# Altium schematic sheet Predajnik.SchDoc
size A3
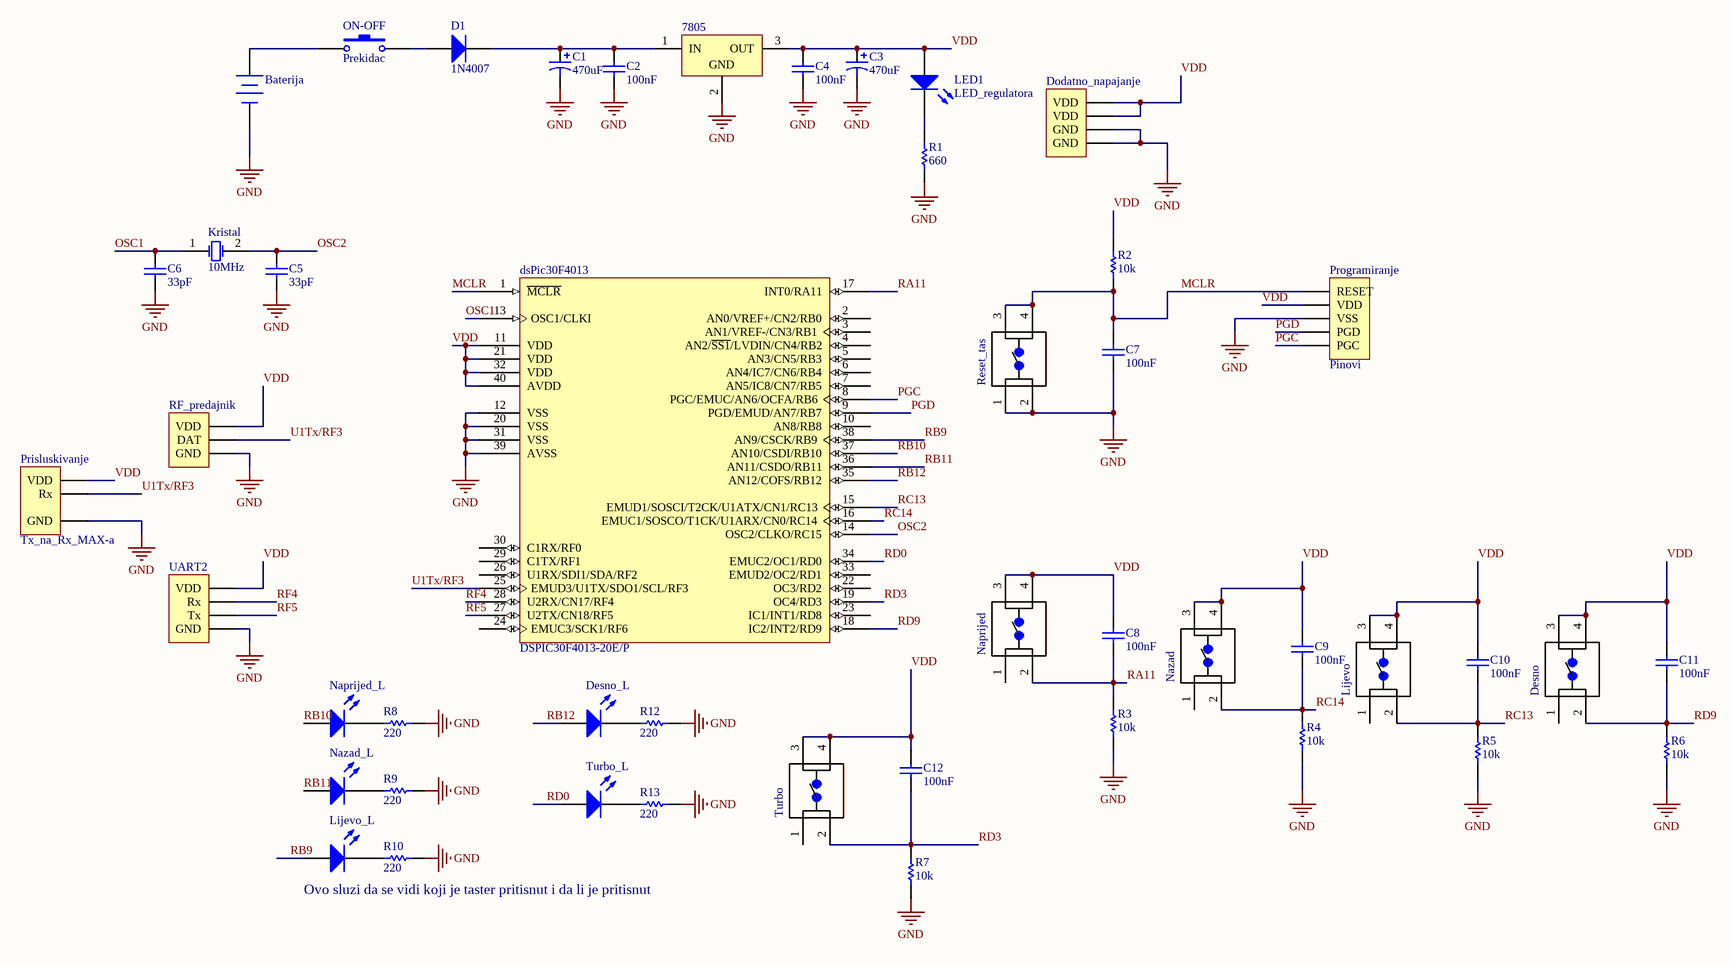
[diagram p0: Predajnik.SchDoc]

## Parts
7805  LM7805CT  [T03B]  (value not drawn)
Baterija  9V  [BAT-2]  (value not drawn)
C1  470uF  [El. Kondenzator 470uf]
C2  100nF  [C blok 100n]
C3  470uF  [El. Kondenzator 470uf]
C4  100nF  [C blok 100n]
C5  33pF  [C keramicki 30pF]
C6  33pF  [C keramicki 30pF]
C7  100nF  [C blok 100n]
C8  100nF  [C blok 100n]
C9  100nF  [C blok 100n]
C10  100nF  [C blok 100n]
C11  100nF  [C blok 100n]
C12  100nF  [C blok 100n]
D1  1N4007  [DO-41]
Desno  3-1825910-1  [*TE_3-1825910-1]  (value not drawn)
Desno_L  LED0  [LED_5mm]  (value not drawn)
Dodatno_napajanje  (no value)  [HDR1X4]
dsPic30F4013  DSPIC30F4013-20E/P  [PDIP600-P40]
Kristal  10MHz  [R38]
LED1  LED_regulatora  [LED_5mm]
Lijevo  3-1825910-1  [*TE_3-1825910-1]  (value not drawn)
Lijevo_L  LED0  [LED_5mm]  (value not drawn)
Naprijed  3-1825910-1  [*TE_3-1825910-1]  (value not drawn)
Naprijed_L  LED0  [LED_5mm]  (value not drawn)
Nazad  3-1825910-1  [*TE_3-1825910-1]  (value not drawn)
Nazad_L  LED0  [LED_5mm]  (value not drawn)
ON-OFF  Prekidac  [SPST-2]
Prisluskivanje  Tx_na_Rx_MAX-a  [HDR1X3]
Programiranje  Pinovi  [HDR1X5]
R1  660  [AXIAL-0.3]
R2  10k  [AXIAL-0.3]
R3  10k  [AXIAL-0.3]
R4  10k  [AXIAL-0.3]
R5  10k  [AXIAL-0.3]
R6  10k  [AXIAL-0.3]
R7  10k  [AXIAL-0.3]
R8  220  [AXIAL-0.3]
R9  220  [AXIAL-0.3]
R10  220  [AXIAL-0.3]
R12  220  [AXIAL-0.3]
R13  220  [AXIAL-0.3]
Reset_tas  3-1825910-1  [*TE_3-1825910-1]  (value not drawn)
RF_predajnik  Header 3  [HDR1X3]  (value not drawn)
Turbo  3-1825910-1  [*TE_3-1825910-1]  (value not drawn)
Turbo_L  LED0  [LED_5mm]  (value not drawn)
UART2  (no value)  [HDR1X4]

## Nets
GND: 7805.2(GND) Baterija.2(-) C1.2 C2.1 C3.2 C4.1 C5.1 C6.1 C7.1 Dodatno_napajanje.3(GND) Dodatno_napajanje.4(GND) dsPic30F4013.12(VSS) dsPic30F4013.20(VSS) dsPic30F4013.31(VSS) dsPic30F4013.39(AVSS) Prisluskivanje.3(GND) Programiranje.3(VSS) R1.1 R3.1 R4.1 R5.1 R6.1 R7.1 R8.2 R9.2 R10.2 R12.2 R13.2 Reset_tas.1 Reset_tas.2 RF_predajnik.3(GND) UART2.4(GND)
MCLR: C7.2 dsPic30F4013.1(~{MCLR}) Programiranje.1(RESET) R2.1 Reset_tas.3 Reset_tas.4
OSC1: C6.2 dsPic30F4013.13(OSC1/CLKI) Kristal.1(OSC1)
OSC2: C5.2 dsPic30F4013.14(OSC2/CLKO/RC15) Kristal.2(OSC2)
PGC: dsPic30F4013.8(PGC/EMUC/AN6/OCFA/RB6) Programiranje.5(PGC)
PGD: dsPic30F4013.9(PGD/EMUD/AN7/RB7) Programiranje.4(PGD)
RA11: C8.1 dsPic30F4013.17(INT0/RA11) Naprijed.2 R3.2
RB9: dsPic30F4013.38(AN9/CSCK/RB9) Lijevo_L.1(A)
RB10: dsPic30F4013.37(AN10/CSDI/RB10) Naprijed_L.1(A)
RB11: dsPic30F4013.36(AN11/CSDO/RB11) Nazad_L.1(A)
RB12: Desno_L.1(A) dsPic30F4013.35(AN12/COFS/RB12)
RC13: C10.1 dsPic30F4013.15(EMUD1/SOSCI/T2CK/U1ATX/CN1/RC13) Lijevo.2 R5.2
RC14: C9.1 dsPic30F4013.16(EMUC1/SOSCO/T1CK/U1ARX/CN0/RC14) Nazad.2 R4.2
RD0: dsPic30F4013.34(EMUC2/OC1/RD0) Turbo_L.1(A)
RD3: C12.1 dsPic30F4013.19(OC4/RD3) R7.2 Turbo.2
RD9: C11.1 Desno.2 dsPic30F4013.18(IC2/INT2/RD9) R6.2
RF4: dsPic30F4013.28(U2RX/CN17/RF4) UART2.2(Rx)
RF5: dsPic30F4013.27(U2TX/CN18/RF5) UART2.3(Tx)
U1Tx/RF3: dsPic30F4013.25(EMUD3/U1TX/SDO1/SCL/RF3) Prisluskivanje.2(Rx) RF_predajnik.2(DAT)
VDD: 7805.3(OUT) C3.1 C4.2 C8.2 C9.2 C10.2 C11.2 C12.2 Desno.3 Desno.4 Dodatno_napajanje.1(VDD) Dodatno_napajanje.2(VDD) dsPic30F4013.11(VDD) dsPic30F4013.21(VDD) dsPic30F4013.32(VDD) dsPic30F4013.40(AVDD) LED1.1(A) Lijevo.3 Lijevo.4 Naprijed.3 Naprijed.4 Nazad.3 Nazad.4 Prisluskivanje.1(VDD) Programiranje.2(VDD) R2.2 RF_predajnik.1(VDD) Turbo.3 Turbo.4 UART2.1(VDD)
Net7805_1: 7805.1(IN) C1.1 C2.2 D1.2(K)
NetBaterija_1: Baterija.1(+) ON-OFF.1
NetD1_1: D1.1(A) ON-OFF.2
NetDesno_L_2: Desno_L.2(K) R12.1
NetLED1_2: LED1.2(K) R1.2
NetLijevo_L_2: Lijevo_L.2(K) R10.1
NetNaprijed_L_2: Naprijed_L.2(K) R8.1
NetNazad_L_2: Nazad_L.2(K) R9.1
NetR13_1: R13.1 Turbo_L.2(K)

Not connected (* = marked no-connect by the designer): Desno 1; dsPic30F4013 2(AN0/VREF+/CN2/RB0) 3(AN1/VREF-/CN3/RB1) 4(AN2/~{SS1}/LVDIN/CN4/RB2) 5(AN3/CN5/RB3) 6(AN4/IC7/CN6/RB4) 7(AN5/IC8/CN7/RB5) 10(AN8/RB8) 22(OC3/RD2) 23(IC1/INT1/RD8) 24(EMUC3/SCK1/RF6) 26(U1RX/SDI1/SDA/RF2) 29(C1TX/RF1) 30(C1RX/RF0) 33(EMUD2/OC2/RD1); Lijevo 1; Naprijed 1; Nazad 1; Turbo 1

## Notes on the sheet
- Ovo sluzi da se vidi koji je taster pritisnut i da li je pritisnut

## Library data of the parts
7805 = LM7905CT: 3-Terminal Negative Regulator, 3-pin TO-220; Manufacturer: National Semiconductor; PackageTopMarking: NSUZXYTTE#*LM7905CT; PowerWise: N; CompType: LDO IC; Published: 4-Dec-2008; DatasheetVersion: Sep-2001; PackageVersion: revL, Jan-1992; PackageReference: T03B; Publisher: Altium Limited; PackageDescription: TO-220, Molded, 3 Lead, Straight; Supplier 1: Farnell; Supplier Part Number 1: 9490370; PartNumber: LM7905CT; RoHS: N; PinCount: 3; ComponentLink1Description: LM7905 Datasheet; ComponentLink1URL: http://www.national.com/ds/LM/LM7905.pdf; ComponentLink2Description: LM7905 Web Page; ComponentLink2URL: http://www.national.com/pf/LM/LM7905.html; ComponentLink3Description: T03B Package Page; ComponentLink3URL: http://www.national.com/packaging/folders/t03b.html
Baterija = Battery: Multicell Battery; Published: 24-Mar-1999; LatestRevisionDate: 17-Jul-2002; LatestRevisionNote: Re-released for DXP Platform.; PackageReference: BAT-2; Publisher: Altium Limited; PackageDescription: Battery; 2 Leads
C1 C3 = Cap Pol1: Polarized Capacitor (Radial); Published: 8-Jun-2000; LatestRevisionDate: 17-Jul-2002; LatestRevisionNote: Re-released for DXP Platform.; PackageReference: RB7.6-15; Publisher: Altium Limited; PackageDescription: Polarized Capacitor (Radial); 2 Leads; Value: 470uF
C2 C4-C12 = Cap: Capacitor; Published: 8-Jun-2000; LatestRevisionDate: 17-Jul-2002; LatestRevisionNote: Re-released for DXP Platform.; PackageReference: RAD-0.3; Publisher: Altium Limited; PackageDescription: Radial Cap, Thru-Hole; 2 Leads; 0.3 in Pin Spacing
  C2 C4 C7-C12: Value: 100nF
  C5 C6: Value: 33pF
D1 = Diode 1N4007: 1 Amp General Purpose Rectifier; Published: 8-Jun-2000; LatestRevisionDate: 17-Jul-2002; LatestRevisionNote: Re-released for DXP Platform.; DatasheetVersion: 1998; PackageVersion: Aug-1999; PackageReference: DO-41; Publisher: Altium Limited; PackageDescription: Diode, Axial; Body 5.2 x 2.7 mm (LxDia. max), Lead Dia. 0.86 mm (max); Code_JEDEC: DO-204-AL; ComponentLink1Description: Manufacturer Link; ComponentLink1URL: http://www.fairchildsemi.com/; ComponentLink2Description: Datasheet; ComponentLink2URL: http://www.fairchildsemi.com/ds/1N%2F1N4001.pdf
Desno Lijevo Naprijed Nazad Reset_tas Turbo = 3-1825910-1: Switch Push Button OFF _ON_ SPST Round Button 0.05A 24VDC Momentary Contact PC Pins Thru-Hole; MF: TE Connectivity; Package: None; Price: None; SnapEDA_Link: https://www.snapeda.com/parts/3-1825910-1/TE%20Connectivity%20ALCOSWITCH%20Switches/view-part/452461/?ref=snap; TE_purchase_URL: https://www.te.com/usa-en/product-3-1825910-1.html?te_bu=Cor&te_type=disp&te_campaign=seda_glo_cor-seda-global-disp-prtnr-fy19-seda-model-bom-cta_sma-317_1&elqCampaignId=32493; MP: 3-1825910-1; EU_RoHS_Compliance: Compliant; Availability: Unavailable; Value: *
Desno_L Lijevo_L Naprijed_L Nazad_L Turbo_L = LED0: Typical INFRARED GaAs LED; Published: 8-Jun-2000; LatestRevisionDate: 08-Jul-2005; LatestRevisionNote: Mech Layer 1 removed.; PackageReference: LED-0; Publisher: Altium Limited; PackageDescription: LED; 2 Leads
Dodatno_napajanje Prisluskivanje UART2 = Header 4: Header, 4-Pin; LatestRevisionDate: 17-Jul-2002; LatestRevisionNote: Re-released for DXP Platform.; Publisher: Altium Limited
dsPic30F4013 = DSPIC30F4013-20E/P: High-Performance 16-bit Digital Signal Controller, 48 KB Flash, 2 KB SRAM, 1 KB EEPROM, 40-Pin PDIP, Extended High Temperature; Published: 29-Jan-2009; DatasheetVersion: revF, Apr-2008; PackageVersion: revBB, Aug-2009; PackageReference: PDIP600-P40; Publisher: Altium Limited; PackageDescription: 40-Lead Plastic Dual In-Line (P) - 600 mil Body [PDIP]; Supplier 1: Digi-Key; Supplier Part Number 1: DSPIC30F4013-20EP-ND; ComponentLink1Description: Datasheet; ComponentLink1URL: http://ww1.microchip.com/downloads/en/DeviceDoc/70138F.pdf; ComponentLink2Description: Packaging Specification; ComponentLink2URL: http://www.microchip.com/stellent/groups/techpub_sg/documents/packagingspec/en012702.pdf; ComponentLink3Description: Microchip.com Home; ComponentLink3URL: http://www.microchip.com/
Kristal = XTAL: Crystal Oscillator; Published: 8-Jun-2000; LatestRevisionDate: 17-Jul-2002; LatestRevisionNote: Re-released for DXP Platform.; PackageReference: R38; Publisher: Altium Limited; PackageDescription: Crystal, Thru-Hole; 2 Leads; Body 3.1 x 8.2 mm (Dia.xH)
LED1 = LED1: Typical RED GaAs LED; Published: 8-Jun-2000; LatestRevisionDate: 08-Jul-2005; LatestRevisionNote: Mech Layer 1 removed.; PackageReference: LED-1; Publisher: Altium Limited; PackageDescription: LED; 2 Leads
ON-OFF = SW-PB: Switch; Published: 24-Mar-1999; LatestRevisionDate: 17-Jul-2002; LatestRevisionNote: Re-released for DXP Platform.; PackageReference: SPST-2; Publisher: Altium Limited; PackageDescription: Switch; 2 Leads
Programiranje = Header 5: Header, 5-Pin; LatestRevisionDate: 17-Jul-2002; LatestRevisionNote: Re-released for DXP Platform.; Publisher: Altium Limited
R1-R10 R12 R13 = Res1: Resistor; Published: 8-Jun-2000; LatestRevisionDate: 17-Jul-2002; LatestRevisionNote: Re-released for DXP Platform.; PackageReference: AXIAL-0.3; Publisher: Altium Limited; PackageDescription: Axial Device, Thru-Hole; 2 Leads; 0.3 in Pin Spacing
  R1: Value: 660
  R2-R7: Value: 10K
  R8-R10 R12 R13: Value: 220
RF_predajnik = Header 3: Header, 3-Pin; LatestRevisionDate: 17-Jul-2002; LatestRevisionNote: Re-released for DXP Platform.; Publisher: Altium Limited